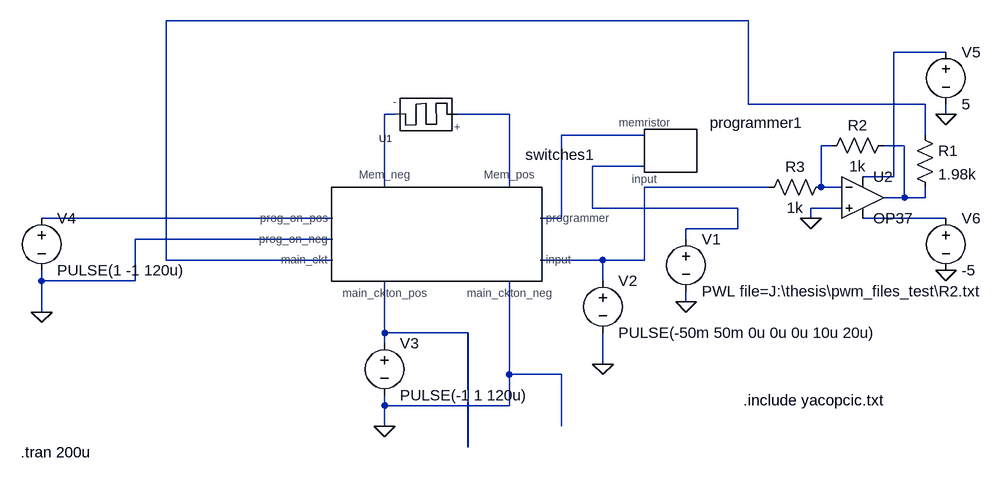
[diagram p0: schematic hudai.asc]
hudai.asc, the LTspice schematic file:
Version 4
SHEET 1 880 3224
WIRE -160 2544 -1056 2544
WIRE 144 2592 64 2592
WIRE -160 2672 -160 2544
WIRE 112 2672 -160 2672
WIRE -704 2688 -720 2688
WIRE -528 2688 -608 2688
WIRE 144 2688 144 2672
WIRE -320 2720 -448 2720
WIRE 112 2720 112 2672
WIRE -32 2736 -48 2736
WIRE 80 2736 48 2736
WIRE -320 2768 -400 2768
WIRE 64 2784 64 2592
WIRE 64 2784 16 2784
WIRE -720 2800 -720 2688
WIRE -528 2800 -528 2688
WIRE -128 2800 -320 2800
WIRE -48 2800 -48 2736
WIRE -16 2800 -48 2800
WIRE 80 2816 80 2736
WIRE 80 2816 48 2816
WIRE 112 2816 112 2800
WIRE 112 2816 80 2816
WIRE -400 2832 -400 2768
WIRE -176 2832 -400 2832
WIRE -16 2832 -64 2832
WIRE -800 2848 -1248 2848
WIRE -448 2848 -448 2720
WIRE -448 2848 -480 2848
WIRE -64 2848 -64 2832
WIRE 144 2848 16 2848
WIRE -176 2864 -176 2832
WIRE -176 2864 -256 2864
WIRE -800 2880 -1104 2880
WIRE -256 2880 -256 2864
WIRE -1056 2912 -1056 2544
WIRE -800 2912 -1056 2912
WIRE -384 2912 -480 2912
WIRE -320 2912 -320 2800
WIRE -320 2912 -384 2912
WIRE -1248 2944 -1248 2928
WIRE -1104 2944 -1104 2880
WIRE -1104 2944 -1248 2944
WIRE -384 2944 -384 2912
WIRE -256 2976 -256 2960
WIRE -1248 2992 -1248 2944
WIRE -720 3024 -720 2944
WIRE -592 3024 -720 3024
WIRE -720 3040 -720 3024
WIRE -384 3072 -384 3024
WIRE -528 3088 -528 2944
WIRE -448 3088 -528 3088
WIRE -720 3136 -720 3120
WIRE -528 3136 -528 3088
WIRE -528 3136 -720 3136
WIRE -720 3168 -720 3136
WIRE -448 3168 -448 3088
WIRE -592 3200 -592 3024
FLAG -256 2976 0
FLAG -384 3072 0
FLAG -720 3168 0
FLAG -1248 2992 0
FLAG 144 2688 0
FLAG 144 2928 0
FLAG -64 2848 0
SYMBOL memristormodel -688 2688 R180
SYMATTR InstName U1
SYMATTR Value MEM_YAKOPCIC
SYMBOL voltage -256 2864 R0
WINDOW 123 0 0 Left 2
WINDOW 39 0 0 Left 2
SYMATTR InstName V1
SYMATTR Value PWL file=J:\thesis\pwm_files_test\R2.txt
SYMBOL voltage -384 2928 R0
WINDOW 123 0 0 Left 2
WINDOW 39 0 0 Left 2
SYMATTR InstName V2
SYMATTR Value PULSE(-50m 50m 0u 0u 0u 10u 20u)
SYMBOL voltage -720 3024 R0
WINDOW 123 0 0 Left 2
WINDOW 39 0 0 Left 2
SYMATTR InstName V3
SYMATTR Value PULSE(-1 1 120u)
SYMBOL voltage -1248 2832 R0
WINDOW 123 0 0 Left 2
WINDOW 39 0 0 Left 2
SYMATTR InstName V4
SYMATTR Value PULSE(1 -1 120u)
SYMBOL programmer_block -272 2768 R0
SYMATTR InstName programmer1
SYMBOL switch_block -720 2848 R0
SYMATTR InstName switches1
SYMBOL Opamps\\OP37 16 2752 R0
SYMATTR InstName U2
SYMBOL res 96 2704 R0
SYMATTR InstName R1
SYMATTR Value 1.98k
SYMBOL res 64 2720 R90
WINDOW 0 0 56 VBottom 2
WINDOW 3 32 56 VTop 2
SYMATTR InstName R2
SYMATTR Value 1k
SYMBOL res -32 2784 R90
WINDOW 0 0 56 VBottom 2
WINDOW 3 32 56 VTop 2
SYMATTR InstName R3
SYMATTR Value 1k
SYMBOL voltage 144 2576 R0
WINDOW 123 0 0 Left 2
WINDOW 39 0 0 Left 2
SYMATTR InstName V5
SYMATTR Value 5
SYMBOL voltage 144 2832 R0
WINDOW 123 0 0 Left 2
WINDOW 39 0 0 Left 2
SYMATTR InstName V6
SYMATTR Value -5
TEXT -1280 3208 Left 2 !.tran 200u
TEXT -168 3128 Left 2 !.include yacopcic.txt

The netlist it stands for:
* hudai.asc
XU1 N004 N003 M MEM_YAKOPCIC  ; pins + -
V1 N008 0 PWL file=J:\thesis\pwm_files_test\R2.txt
V2 N009 0 PULSE(-50m 50m 0u 0u 0u 10u 20u)
V3 N012 0 PULSE(-1 1 120u)
V4 N010 0 PULSE(1 -1 120u)
Xprogrammer1 N005 N008 programmer_block  ; pins memristor input
Xswitches1 N003 N004 N010 0 N001 N012 0 N005 N009 switch_block  ; pins Mem_neg Mem_pos prog_on_pos prog_on_neg main_ckt main_ckton_pos main_ckton_neg programmer input
XU2 0 N006 N002 N011 N007 LT1037  ; OP37, pins In+ In- V+ V- OUT
R1 N001 N007 1.98k
R2 N007 N006 1k
R3 N006 N009 1k
V5 N002 0 5
V6 N011 0 -5
.tran 200u
.include yacopcic.txt
.lib LTC.lib
.backanno
.end